# EAGLE schematic RCREMOTE_SCH (EAGLE 9.7.0)
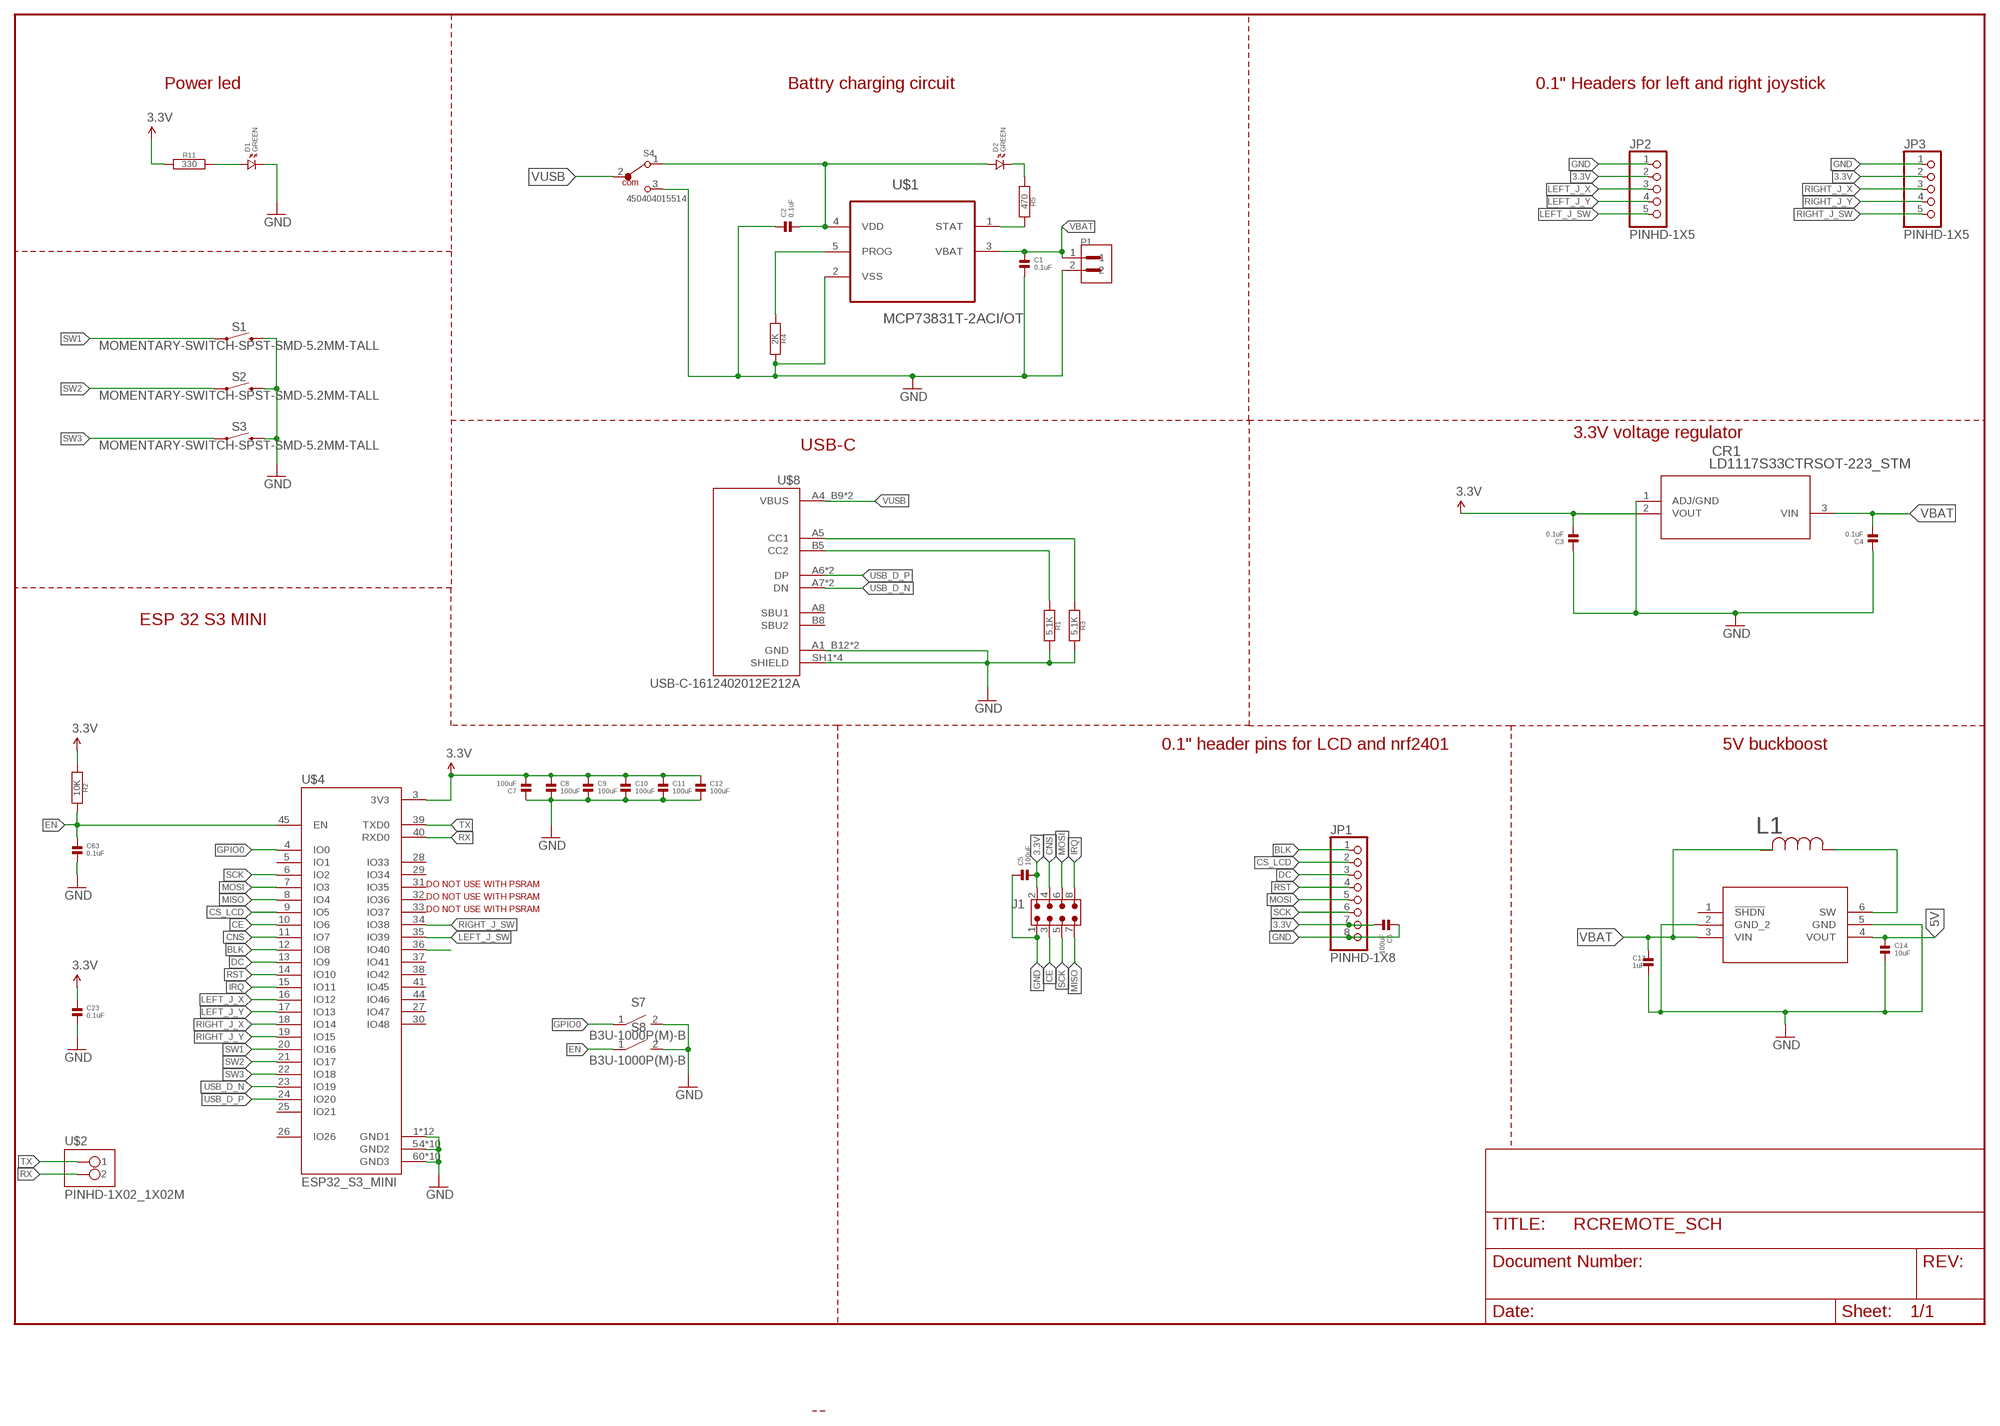
[diagram p0: schematic, sheet 1]

## Parts
C1  0.1uF  CAPACITOR.0402  [0402]
C2  0.1uF  CAPACITOR.0402  [0402]
C3  0.1uF  CAPACITOR.0402  [0402]
C4  0.1uF  CAPACITOR.0402  [0402]
C5  100uF  CAPACITOR.0402  [0402]
C6  100uF  CAPACITOR.0402  [0402]
C7  100uF  CAPACITOR.0402  [0402]
C8  100uF  CAPACITOR.0402  [0402]
C9  100uF  CAPACITOR.0402  [0402]
C10  100uF  CAPACITOR.0402  [0402]
C11  100uF  CAPACITOR.0402  [0402]
C12  100uF  CAPACITOR.0402  [0402]
C13  1uF  CAPACITOR.0402  [0402]
C14  10uF  CAPACITOR.0402  [0402]
C23  0.1uF  CAPACITOR.0402  [0402]
C63  0.1uF  CAPACITOR.0402  [0402]
CR1  LD1117S33CTRSOT-223_STM  [SOT-223_STM]
D1  GREEN  LED.0402  [0402.LED]
D2  GREEN  LED.0402  [0402.LED]
J1  6130XX21121_61300821121  [61300821121]
JP1  PINHD-1X8  [1X08]
JP2  PINHD-1X5  [1X05]
JP3  PINHD-1X5  [1X05]
L1  LBR2012T100KIND_TAIYO_LBR2012_TAY  [IND_TAIYO_LBR2012_TAY]
P1  S2B-PH-SM4-TB  [JST_S2B-PH-SM4-TB]
R1  5.1K  RESISTOR.0402  [0402]
R2  10K  RESISTOR.0402  [0402]
R3  5.1K  RESISTOR.0402  [0402]
R4  2K  RESISTOR.0402  [0402]
R5  470  RESISTOR.0402  [0402]
R11  330  RESISTOR.0402  [0402]
S1  MOMENTARY-SWITCH-SPST-SMD-5.2MM-TALL  [TACTILE_SWITCH_SMD_5.2MM]
S2  MOMENTARY-SWITCH-SPST-SMD-5.2MM-TALL  [TACTILE_SWITCH_SMD_5.2MM]
S3  MOMENTARY-SWITCH-SPST-SMD-5.2MM-TALL  [TACTILE_SWITCH_SMD_5.2MM]
S4  450404015514  [450404015514]
S7  B3U-1000P(M)-B  B3U-X000B3U-1000P(M)-B1000P(M)-B  [B3U-1000P(M)-B]
S8  B3U-1000P(M)-B  B3U-X000B3U-1000P(M)-B1000P(M)-B  [B3U-1000P(M)-B]
U1  LTC3525ESC6-3.3TRMPBFSC70-SC6_LIT  [SC70-SC6_LIT]
U$1  MCP73831T-2ACI/OT  [SOT95P280X145-5N]
U$2  PINHD-1X02_1X02M  [1X02]
U$4  ESP32_S3_MINI  [XCVR_ESP32_S3_MINI-1-N4R2]
U$8  USB-C-1612402012E212A  [12402012E212A]

## Nets
3.3V [diff_pair]: C3.2 C5.2 C6.2 C7.2 C8.1 C9.1 C10.1 C11.1 C12.1 C23.1 CR1.2(VOUT) J1.2 JP1.7 JP2.2 JP3.2 R2.1 R11.1 U$4.3(3V3)
5V [diff_pair]: C14.1 U1.4(VOUT)
BLK: JP1.1 U$4.12(IO8)
CE: J1.3 U$4.10(IO6)
CNS: J1.4 U$4.11(IO7)
CS_LCD: JP1.2 U$4.9(IO5)
DC: JP1.3 U$4.13(IO9)
EN: C63.1 R2.2 S8.1 U$4.45(EN)
GND [GND]: C1.2 C2.1 C3.1 C4.1 C5.1 C6.1 C7.1 C8.2 C9.2 C10.2 C11.2 C12.2 C13.2 C14.2 C23.2 C63.2 CR1.1(ADJ/GND) D1.P$2 J1.1 JP1.8 JP2.1 JP3.1 P1.2 R1.2 R3.2 R4.2 S1.3 S2.3 S3.3 S4.3 S7.2 S8.2 U1.2(GND_2) U1.5(GND) U$1.2(VSS) U$4.1(GND1) U$4.2(GND1) U$4.42(GND1) U$4.43(GND1) U$4.46(GND1) U$4.47(GND1) U$4.48(GND1) U$4.49(GND1) U$4.50(GND1) U$4.51(GND1) U$4.52(GND1) U$4.53(GND1) U$4.54(GND2) U$4.55(GND2) U$4.56(GND2) U$4.57(GND2) U$4.58(GND2) U$4.59(GND2) U$4.60(GND3) U$4.61_1(GND3) U$4.61_2(GND3) U$4.61_3(GND3) U$4.61_4(GND3) U$4.61_5(GND3) U$4.61_6(GND3) U$4.61_7(GND3) U$4.61_8(GND3) U$4.61_9(GND3) U$4.62(GND2) U$4.63(GND2) U$4.64(GND2) U$4.65(GND2) U$8.A1_B12(GND) U$8.B1_A12(GND) U$8.SH1(SHIELD) U$8.SH2(SHIELD) U$8.SH3(SHIELD) U$8.SH4(SHIELD)
GPIO0: S7.1 U$4.4(IO0)
IRQ: J1.8 U$4.15(IO11)
LEFT_J_SW: JP2.5 U$4.35(IO39)
LEFT_J_X: JP2.3 U$4.16(IO12)
LEFT_J_Y: JP2.4 U$4.17(IO13)
MISO: J1.7 U$4.8(IO4)
MOSI: J1.6 JP1.5 U$4.7(IO3)
N$1: R1.1 U$8.B5(CC2)
N$2: R3.1 U$8.A5(CC1)
N$3: D1.P$1 R11.2
N$5: D2.P$2 R5.1
N$6: R5.2 U$1.1(STAT)
N$7: C2.2 D2.P$1 S4.1 U$1.4(VDD)
N$8: R4.1 U$1.5(PROG)
N$10: L1.1 U1.6(SW)
N$11: U$4.36(IO40)
RIGHT_J_SW: JP3.5 U$4.34(IO38)
RIGHT_J_X: JP3.3 U$4.18(IO14)
RIGHT_J_Y: JP3.4 U$4.19(IO15)
RST: JP1.4 U$4.14(IO10)
RX: U$2.2 U$4.40(RXD0)
SCK: J1.5 JP1.6 U$4.6(IO2)
SW1: S1.1 U$4.20(IO16)
SW2: S2.1 U$4.21(IO17)
SW3: S3.1 U$4.22(IO18)
TX: U$2.1 U$4.39(TXD0)
USB_D_N: U$4.23(IO19) U$8.A7(DN) U$8.B7(DN)
USB_D_P: U$4.24(IO20) U$8.A6(DP) U$8.B6(DP)
VBAT: C1.1 C4.2 C13.1 CR1.3(VIN) L1.2 P1.1 U1.3(VIN) U$1.3(VBAT)
VUSB: S4.2 U$8.A4_B9(VBUS) U$8.B4_A9(VBUS)
Unconnected: U1.1(!SHDN) U$4.5(IO1) U$4.25(IO21) U$4.26(IO26) U$4.27(IO47) U$4.28(IO33) U$4.29(IO34) U$4.30(IO48) U$4.31(IO35) U$4.32(IO36) U$4.33(IO37) U$4.37(IO41) U$4.38(IO42) U$4.41(IO45) U$4.44(IO46) U$8.A8(SBU1) U$8.B8(SBU2)

## Notes on the sheet
- Power led | Battry charging circuit | 0.1" Headers for left and right joystick
- 3.3V voltage regulator
- USB-C
- ESP 32 S3 MINI
- 0.1" header pins for LCD and nrf2401 | 5V buckboost
- DO NOT USE WITH PSRAM
- DO NOT USE WITH PSRAM
- DO NOT USE WITH PSRAM

## Library data of the parts
C1-C14 C23 C63 = CL-StandardParts:CAPACITOR
CR1 = LD1117:LD1117S33CTR; COPYRIGHT: Copyright (C) 2024 Ultra Librarian. All rights reserved.; MANUFACTURER_PART_NUMBER: LD1117S33CTR; MFR_NAME: STMicroelectronics
D1 D2 = CL-StandardParts:LED
J1 = 6130XX21121_61300821121:6130XX21121_61300821121
JP1 = Connector:PINHD-1X8: PIN HEADER; CATEGORY: Headers; DESCRIPTION: Header, Straight, 8 Position; MANUFACTURER: Generic; MPN: Generic; OPERATING_TEMPERATURE: Generic; PART_STATUS: Active; PITCH: 0.100" (2.54mm); ROHS_COMPLIANCE: Generic; SERIES: Generic; SUB-CATEGORY: Headers, Male Pins; TYPE: Board to Board or Cable, Unshrouded, Through Hole, Straight
JP2 JP3 = Connector:PINHD-1X5: PIN HEADER; CATEGORY: Headers; DESCRIPTION: Header, Straight, 5 Position; MANUFACTURER: Generic; MPN: Generic; OPERATING_TEMPERATURE: Generic; PART_STATUS: Active; PITCH: 0.100" (2.54mm); ROHS_COMPLIANCE: Generic; SERIES: Generic; SUB-CATEGORY: Headers, Male Pins; TYPE: Board to Board or Cable, Unshrouded, Through Hole, Straight
L1 = 2025-04-16_01-13-47_Library:LBR2012T100K; COPYRIGHT: Copyright (C) 2025 Ultra Librarian. All rights reserved.; MANUFACTURER_PART_NUMBER: LBR2012T100K; MFR_NAME: Taiyo Yuden
P1 = S2B-PH-SM4-TB:S2B-PH-SM4-TB; MANUFACTURER: JST
R1-R5 R11 = CL-StandardParts:RESISTOR
S1-S3 = SparkFun-Switches:MOMENTARY-SWITCH-SPST: Momentary Switch (Pushbutton) - SPST Normally-open (NO) SPST momentary switches (buttons, pushbuttons). Variants PTH-12MM - 12mm square, through-hole Momentary Pushbutton Switch - 12mm Square <https://www.sparkfun.com/products/9190> (COM-09190) PTH-6.0MM, PTH-6.0MM-KIT - 6.0mm square, through-hole Mini Pushbutton Switch <https://www.sparkfun.com/products/97> (COM-00097) KIT package intended for soldering kit's - only one side of pads' copper is exposed. PTH-RIGHT-ANGLE-KIT - Right-angle, through-hole Right Angle Tactile Button <https://www.sparkfun.com/products/10791> - Used on SparkFun BigTime Watch Kit <https://www.sparkfun.com/products/11734> SMD-12MM - 12mm square, surface-mount Tactile Button - SMD (12mm) <https://www.sparkfun.com/products/12993> (COM-12993) Used on SparkFun PicoBoard <https://www.sparkfun.com/products/11888> SMD-4.5MM - 4.5mm Square Trackball Switch Used on SparkFun Blackberry Trackballer Breakout <https://www.sparkfun.com/products/13169> SMD-4.6MMX2.8MM - 4.60mm x 2.80mm, surface mount Used on SparkFun Pro Micro - RP2040 <https://www.sparkfun.com/products/17717> SMD-5.2MM, SMD-5.2-REDUNDANT - 5.2mm square, surface-mount Mini Pushbutton Switch - SMD <https://www.sparkfun.com/products/8720> (COM-08720) Used on Arduino Pro Mini <https://www.sparkfun.com/products/11114> REDUNDANT package connects both switch circuits together SMD-6.0X3.5MM - 6.0 x 3.5mm, surface mount Momentary Reset Switch SMD <https://www.sparkfun.com/products/8229> (COM-08229) SMD-6.2MM-TALL - 6.2mm square, surface mount Tactile Button - SMD (6mm) <https://www.sparkfun.com/products/12992> Used on SparkFun Digital Sandbox <https://www.sparkfun.com/products/12651> SMD-RIGHT-ANGLE - Right-angle, surface mount Used on SparkFun Block for Intel® Edison - Arduino <https://www.sparkfun.com/products/13036>; PROD_ID: SWCH-14139
S4 = 450404015514:450404015514
S7 S8 = Switch:B3U-X000: Ultra-small Tactile Switch Contact form : SPST-NO Datasheet <https://omronfs.omron.com/en_US/ecb/products/pdf/en-b3u.pdf>; CATEGORY: SWITCH; DESCRIPTION: Ultra-small Surface-mounting Tactile Switches with High Contact Reliability; MANUFACTURER: OMRON; OPERATING_TEMPERATURE: -25°C to +70°C at 60%RH max; PART_STATUS: ACTIVE; SERIES: B3U; TYPE: Tactile
U1 = 2025-04-16_00-30-35_Library:LTC3525ESC6-3.3TRMPBF; COPYRIGHT: Copyright (C) 2025 Ultra Librarian. All rights reserved.; MANUFACTURER_PART_NUMBER: LTC3525ESC6-3.3#TRMPBF; MFR_NAME: Analog Devices Inc
U$1 = MCP73831T-2ACI_OT:MCP73831T-2ACI/OT; MPN: MCP73831T-2ACI/OT; OC_FARNELL: 1332158; OC_NEWARK: 56K7045; PACKAGE: SOT-5; SUPPLIER: Microchip
U$2 = Tinkercad:PINHD-1X02
U$4 = CL-Digital IC:ESP32_S3_MINI; DIGIKEY: 1965-ESP32-S3-MINI-1-N4R2CT-ND; LCSC: C3013941
U$8 = CL-Connectors:USB-C-16; DIGIKEY: 664-12402012E212ACT-ND; LCSC: C393939

## Net classes
3 GND: width 0.254 mm